# Altium project BoardC.PrjPcb
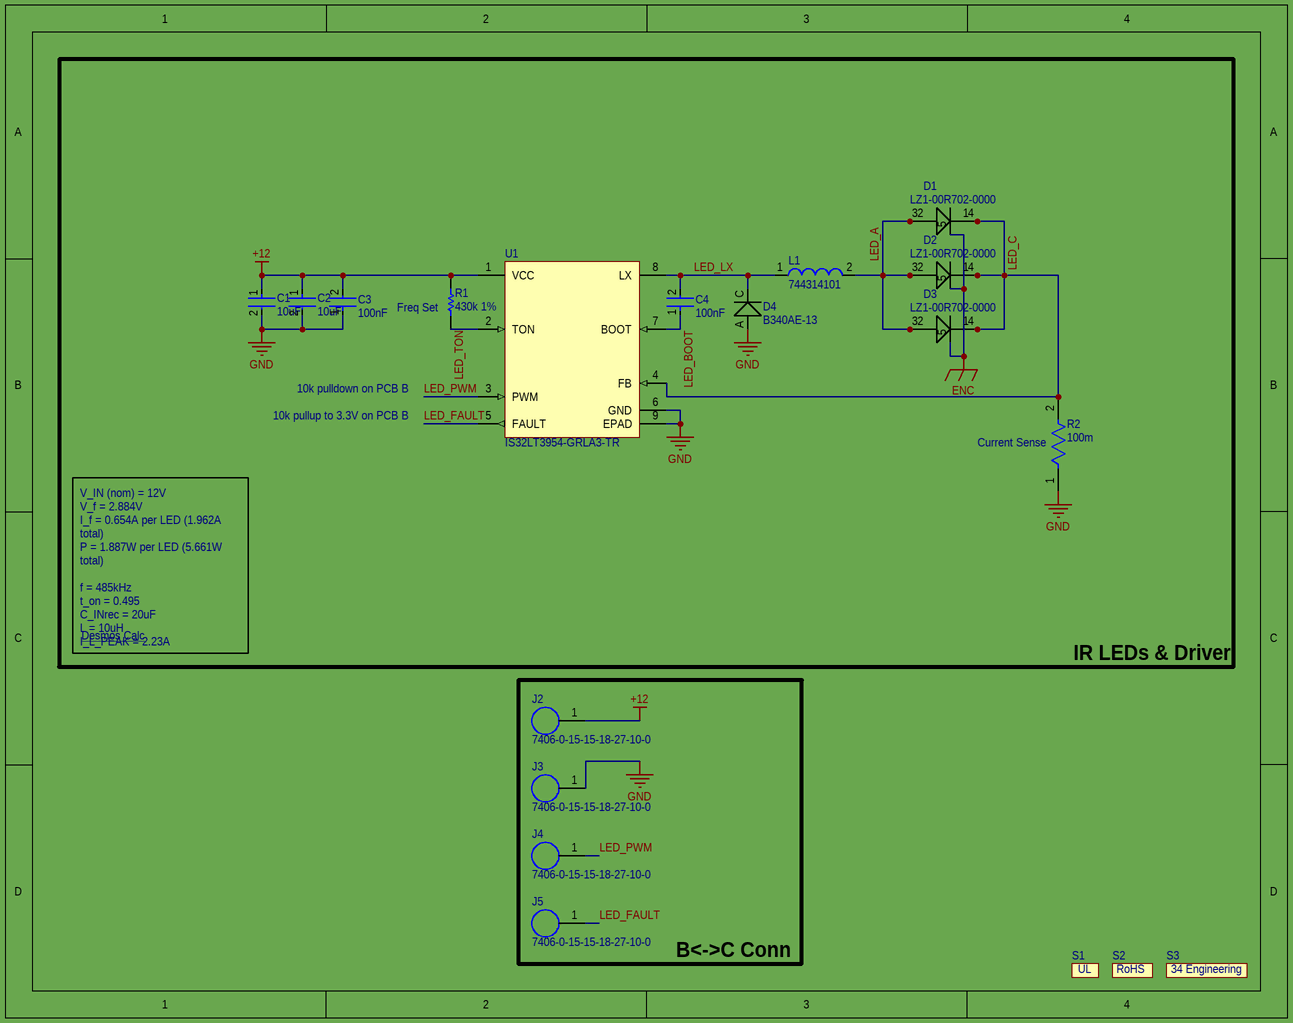
[diagram p0: BoardC.SchDoc]
1 sheet, 19 parts. Net scope: global (net labels, ports and power ports of the same name join across sheets).
Board file: BoardC.PcbDoc

## Sheet BoardC.SchDoc
size A; SheetNumber: 1; SheetTotal: 1; SPICEModelCacheBKDCXLER: <root> / <DocumentId>BKDCXLER</DocumentId> / </root>

### Parts
C1  10uF  [FP-GRM188-0_2-MFG]
C2  10uF  [FP-GRM188-0_2-MFG]
C3  100nF  [FP-CGA3E-0_3-0_1-IPC_C]
C4  100nF  [FP-CGA3E-0_3-0_1-IPC_C]
D1  LZ1-00R702-0000  [LZ1-00R702-0000]
D2  LZ1-00R702-0000  [LZ1-00R702-0000]
D3  LZ1-00R702-0000  [LZ1-00R702-0000]
D4  B340AE-13  [B340AE-13]
J2  7406-0-15-15-18-27-10-0  [7406-0-15-15-18-27-10-0]
J3  7406-0-15-15-18-27-10-0  [7406-0-15-15-18-27-10-0]
J4  7406-0-15-15-18-27-10-0  [7406-0-15-15-18-27-10-0]
J5  7406-0-15-15-18-27-10-0  [7406-0-15-15-18-27-10-0]
L1  744314101  [WE-HCI-7050]
R1  430k 1%  [RESC1608X55X30LL15T15]
R2  100m  [FP-ERJ6D-MFG]
S1  (no value)  [UL]
S2  (no value)  [RoHS]
S3  (no value)  [34EngineeringLogo]
U1  IS32LT3954-GRLA3-TR  [IS32LT3954-GRLA3-TR]

### Blocks framed on the sheet
IR LEDs & Driver: C1-C4 D1-D4 L1 R1 R2 U1
B<->C Conn: J2-J5

### Nets
+12: C1.1 C2.1 C3.2 J2.1 R1.2 U1.1(VCC)
ENC: D1.5 D2.5 D3.5
GND: C1.2 C2.2 C3.1 D4.A J3.1 R2.1 U1.6(GND) U1.9(EPAD)
LED_A: D1.2 D1.3 D2.2 D2.3 D3.2 D3.3 L1.2
LED_BOOT: C4.1 U1.7(BOOT)
LED_C: D1.1 D1.4 D2.1 D2.4 D3.1 D3.4 R2.2 U1.4(FB)
LED_FAULT: J5.1 U1.5(FAULT)
LED_LX: C4.2 D4.C L1.1 U1.8(LX)
LED_PWM: J4.1 U1.3(PWM)
LED_TON: R1.1 U1.2(TON)

### Notes on the sheet
- (near R1) Freq Set
- 10k pullup to 3.3V on PCB B
- 10k pulldown on PCB B
- (near R2) Current Sense
- Desmos Calc <https://www.desmos.com/calculator/gnvyw7eofq>
- V_IN (nom) = 12V
  V_f = 2.884V
  I_f = 0.654A per LED (1.962A total)
  P = 1.887W per LED (5.661W total)
  f = 485kHz
  t_on = 0.495
  C_INrec = 20uF
  L = 10uH
  I_L_PEAK = 2.23A
- (in symbol 34EngineeringLogo) 34 Engineering

### Library data of the parts
C1 C2 = CMP-2006-02520-2: Chip Multilayer Ceramic Capacitors for General Purpose, 0603, 10uF, X5R, 15%, 20%, 25V; Tolerance: 20%; Resistor Type: Ceramic; Voltage: 25V; Max Operating Temperature: 85°C; Min Operating Temperature: -55°C; Capacitance: 10uF; Dielectric: X5R; Lead Free: Lead Free; REACH SVHC: No SVHC; Case/Package: 0603; Mount: Surface Mount; Voltage Rating (DC): 25V; Height: 0.8mm; Length: 1.6mm; Thickness: 0.031inch; Width: 0.031inch; Termination: SMD/SMT; Case Code (Imperial): 0603; Case Code (Metric): 1608; Package Quantity: 1; Packaging: Tape and Reel; Depth: 0.8mm; Voltage Rating: 25V; Weight: 0.000222oz; Number of Pins: 2
C3 C4 = CMP-2000-07546-2: Cap Ceramic 100nF 50V X7R 10% Pad SMD 0603 +125°C Automotive T/R; Weight: 7.1E-05oz; Composition: Ceramic; Max Operating Temperature: 125°C; Termination: SMD/SMT; Dielectric: X7R; Length: 1.6mm; Package Quantity: 1; REACH SVHC: No SVHC; Lead Free: Lead Free; Case Code (Metric): 1608; Min Operating Temperature: -55°C; Packaging: Tape and Reel; Tolerance: 10%; Voltage Rating: 50V; Case Code (Imperial): 0603; Capacitance: 100nF; Case/Package: 0603; Voltage Rating (DC): 50V; Depth: 0.8mm; Radiation Hardening: No; Ratings: AEC-Q200; Mount: Surface Mount; Voltage: 50V; Thickness: 0.035inch; Width: 0.8mm; Height: 0.8mm
D1-D3 = LZ1-00R702-0000: IR Emitter 940nm 1600mW 1200mA 3.05V 4-Pin CSMD T/R; Manufacturer: LED Engin; Viewing Angle: 90°; Forward Voltage: 3V; Touchscreen: Infrared (IR); Supplier 1: Arrow Electronics; Manufacturer Part Number: LZ1-00R702-0000; RoHS: Yes; Mount: Surface Mount; Case/Package: SMD/SMT; Packaging: Tape and Reel; Wavelength: 940nm; Orientation: Top View; ComponentLink1URL: http://www.ledengin.com/files/products/LZ1/LZ1-00R702.pdf?src-supplier=Digi-Key; ComponentLink1Description: http://www.ledengin.com/files/products/LZ1/LZ1-00R702.pdf?src-supplier=Digi-Key; Supplier Part Number 1: LZ1-00R702-0000
D4 = B340AE-13: Rectifier Diode Schottky 40V 3A 2-Pin SMA T/R; Manufacturer: Diodes; Average Rectified Current: 2A; Supplier 1: Newark; Manufacturer Part Number: B340AE-13; RoHS: Yes; Category: Rectifier Diodes; Stock 1: 4255; Pricing 1: 1=0.56000, 5=0.56000, 10=0.46300, 25=0.41400, 50=0.36500, 100=0.31600, 250=0.27700, 500=0.23700, 1000=0.17800 (USD); Mount: Surface Mount; Case/Package: SMA; Packaging: Tape and Reel; Max Reverse Voltage (DC): 40V; RoHS Compliant: Yes; ComponentLink1URL: https://www.diodes.com/assets/Datasheets/B320AE-B345AE.pdf?src-supplier=Digi-Key; ComponentLink1Description: https://www.diodes.com/assets/Datasheets/B320AE-B345AE.pdf?src-supplier=Digi-Key; Supplier Part Number 1: 07AH3680
J2-J5 = 7406-0-15-15-18-27-10-0: 3.05 mm PCB Through Hole Pin Receptacle for (0.94 to 1.09 mm Pin) w/ No Tail; Manufacturer: Mill-Max; Plating: Gold; Current Rating: 8A; Outside Diameter: 2.31mm; Hole Diameter: 1.8mm; Supplier 1: Arrow Electronics; Manufacturer Part Number: 7406-0-15-15-18-27-10-0; RoHS: Yes; Category: Terminals; Stock 1: 1000; Pricing 1: 1=0.49460, 10=0.42540 (USD); Mount: Through Hole; Material: BERYLLIUM COPPER ALLOY; Package Quantity: 500; Packaging: Bulk; Termination: Solder; Length: 0.12inch; Lead Free: Contains Lead; RoHS Compliant: Yes; ComponentLink1URL: https://datasheet.ciiva.com/12487/7406-0-15-15-18-27-10-0-72490-12487100.pdf?src-supplier=Mouser; ComponentLink1Description: https://datasheet.ciiva.com/12487/7406-0-15-15-18-27-10-0-72490-12487100.pdf?src-supplier=Mouser; Supplier Part Number 1: 7406-0-15-15-18-27-10-0
L1 = CMP-0226-00077-1: SMD Flat Wire High Current Inductor WE-HCI, L=10.0 µH; Inductance: 10.0 ÂµH; PackageVersion: 2008; ComponentLink1URL: http://www.we-online.com; DatasheetVersion: ver 1, Aug-2009; ComponentLink2URL: http://www.we-online.de/katalog/media/pdf/744314101.pdf; PackageDescription: SMD Inductor, 2-Leads, Body 7.0 x 6.9 mm; ComponentLink2Description: Datasheet; ComponentLink1Description: Manufacturer Link; PackageReference: WE-HCI-7050
R1 = CMP-2000-00500-1: Manufacturer: Panasonic; Part Number: ERJ-3EKF4303V
R2 = CMP-05422-000098-1: RES 0.1 OHM 1% 1/2W 0805; Temperature Coefficient: 150ppm/°C; Resistance: 100mR; Max Power Dissipation: 500mW; Tolerance: 1%; Length: 0.079inch; Features: Automotive AEC-Q200; Width: 0.049inch; Resistor Type: Thick Film; Case Code (Metric): 2012; Number of Terminations: 2; Max Operating Temperature: 155°C; Case/Package: 0805; Height: 0.028inch; Packaging: Cut Tape; Case Code (Imperial): 0805; Min Operating Temperature: -55°C
S1 = UL
S2 = RoHS
S3 = 34EngineeringLogo: 34 Engineering Silkscreen Logo
U1 = IS32LT3954-GRLA3-TR: 3.0A Dimmable Buck Switching Regulator with Fault Reporting, Spread Spectrum, SOP-8-EP; Manufacturer: ISSI; Supplier 1: Digi-Key; Manufacturer Part Number: IS32LT3954-GRLA3-TR; RoHS: Yes; Stock 1: 27850; Pricing 1: 1=1.94000, 10=1.74200, 25=1.64320, 100=1.39980, 250=1.31440, 500=1.15010, 1000=0.95294 (USD); RoHS Compliant: Yes; Supplier Part Number 1: 2521-IS32LT3954-GRLA3-TRCT-ND